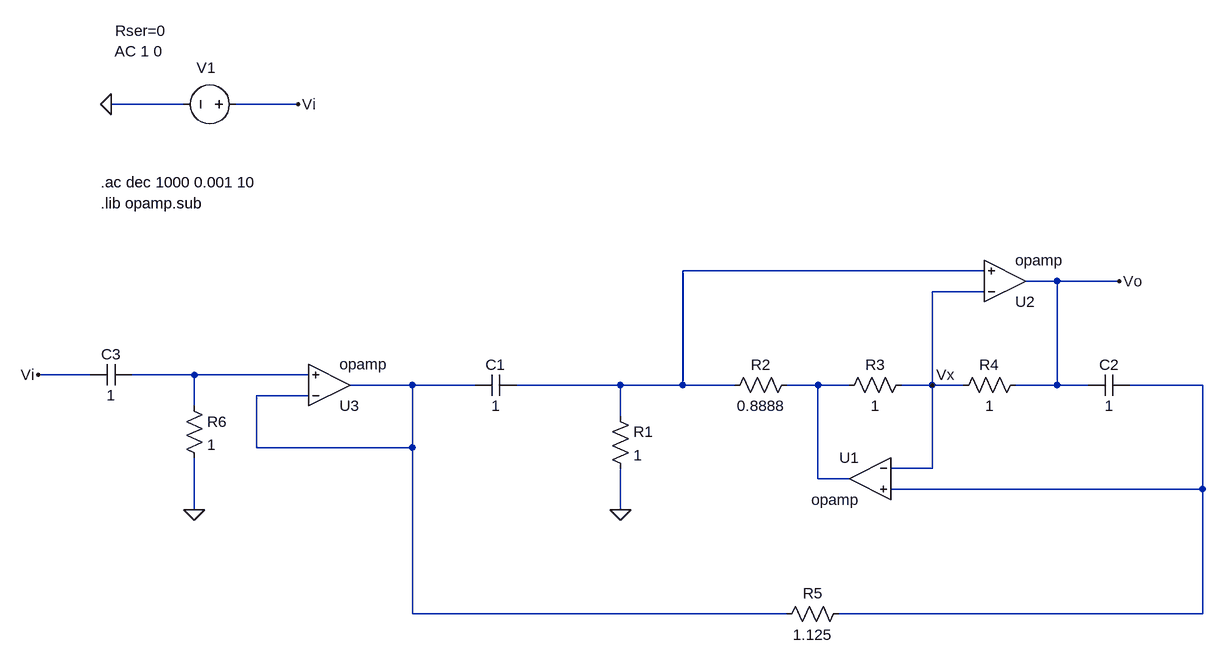
[diagram p0: schematic Circuit.asc]
Circuit.asc, the LTspice schematic file:
Version 4
SHEET 1 880 680
WIRE -784 -272 -896 -272
WIRE -608 -272 -704 -272
WIRE 448 -16 -16 -16
WIRE 560 0 512 0
WIRE 656 0 560 0
WIRE 448 16 368 16
WIRE -928 144 -1008 144
WIRE -768 144 -864 144
WIRE -592 144 -768 144
WIRE -432 160 -528 160
WIRE -336 160 -432 160
WIRE -112 160 -272 160
WIRE -16 160 -16 -16
WIRE -16 160 -112 160
WIRE 64 160 -16 160
WIRE 192 160 144 160
WIRE 240 160 192 160
WIRE 368 160 368 16
WIRE 368 160 320 160
WIRE 416 160 368 160
WIRE 560 160 560 0
WIRE 560 160 496 160
WIRE 608 160 560 160
WIRE 784 160 672 160
WIRE -592 176 -672 176
WIRE -768 192 -768 144
WIRE -112 208 -112 160
WIRE -672 256 -672 176
WIRE -432 256 -432 160
WIRE -432 256 -672 256
WIRE 368 288 368 160
WIRE 368 288 304 288
WIRE 192 304 192 160
WIRE 240 304 192 304
WIRE 784 320 784 160
WIRE 784 320 304 320
WIRE -768 352 -768 272
WIRE -112 352 -112 288
WIRE -432 512 -432 256
WIRE 144 512 -432 512
WIRE 784 512 784 320
WIRE 784 512 224 512
FLAG -112 352 0
FLAG 656 0 Vo
FLAG -608 -272 Vi
FLAG -896 -272 0
FLAG 368 160 Vx
FLAG -1008 144 Vi
FLAG -768 352 0
SYMBOL res -128 192 R0
SYMATTR InstName R1
SYMATTR Value 1
SYMBOL res 160 144 R90
WINDOW 0 0 56 VBottom 2
WINDOW 3 32 56 VTop 2
SYMATTR InstName R2
SYMATTR Value 0.8888
SYMBOL res 336 144 R90
WINDOW 0 0 56 VBottom 2
WINDOW 3 32 56 VTop 2
SYMATTR InstName R3
SYMATTR Value 1
SYMBOL res 512 144 R90
WINDOW 0 0 56 VBottom 2
WINDOW 3 32 56 VTop 2
SYMATTR InstName R4
SYMATTR Value 1
SYMBOL res 240 496 R90
WINDOW 0 0 56 VBottom 2
WINDOW 3 32 56 VTop 2
SYMATTR InstName R5
SYMATTR Value 1.125
SYMBOL cap -272 144 R90
WINDOW 0 0 32 VBottom 2
WINDOW 3 32 32 VTop 2
SYMATTR InstName C1
SYMATTR Value 1
SYMATTR SpiceLine Rser=0
SYMBOL cap 672 144 R90
WINDOW 0 0 32 VBottom 2
WINDOW 3 32 32 VTop 2
SYMATTR InstName C2
SYMATTR Value 1
SYMATTR SpiceLine Rser=0
SYMBOL OpAmps\\opamp 272 240 M0
SYMATTR InstName U1
SYMBOL OpAmps\\opamp 480 64 M180
SYMATTR InstName U2
SYMBOL voltage -688 -272 R90
WINDOW 123 -82 129 VRight 2
WINDOW 39 -113 123 VRight 2
WINDOW 0 -56 47 VRight 2
SYMATTR Value2 AC 1 0
SYMATTR SpiceLine Rser=0
SYMATTR InstName V1
SYMATTR Value ""
SYMBOL OpAmps\\opamp -560 224 M180
SYMATTR InstName U3
SYMBOL cap -864 128 R90
WINDOW 0 0 32 VBottom 2
WINDOW 3 32 32 VTop 2
SYMATTR InstName C3
SYMATTR Value 1
SYMATTR SpiceLine Rser=0
SYMBOL res -784 176 R0
SYMATTR InstName R6
SYMATTR Value 1
TEXT -912 -120 Left 2 !.lib opamp.sub
TEXT -912 -152 Left 2 !.ac dec 1000 0.001 10

The netlist it stands for:
* Circuit.asc
R1 N001 0 1
R2 N004 N001 0.8888
R3 Vx N004 1
R4 Vo Vx 1
R5 N005 N003 1.125
C1 N001 N003 1 Rser=0
C2 N005 Vo 1 Rser=0
XU1 Vx N005 N004 opamp Aol=100K GBW=10Meg  ; pins invin noninvin out
XU2 Vx N001 Vo opamp Aol=100K GBW=10Meg  ; pins invin noninvin out
V1 Vi 0 AC 1 0 Rser=0
XU3 N003 N002 N003 opamp Aol=100K GBW=10Meg  ; pins invin noninvin out
C3 N002 Vi 1 Rser=0
R6 N002 0 1
.lib opamp.sub
.ac dec 1000 0.001 10
.backanno
.end

* Results of the author's LTspice run, read from the files saved beside the schematic
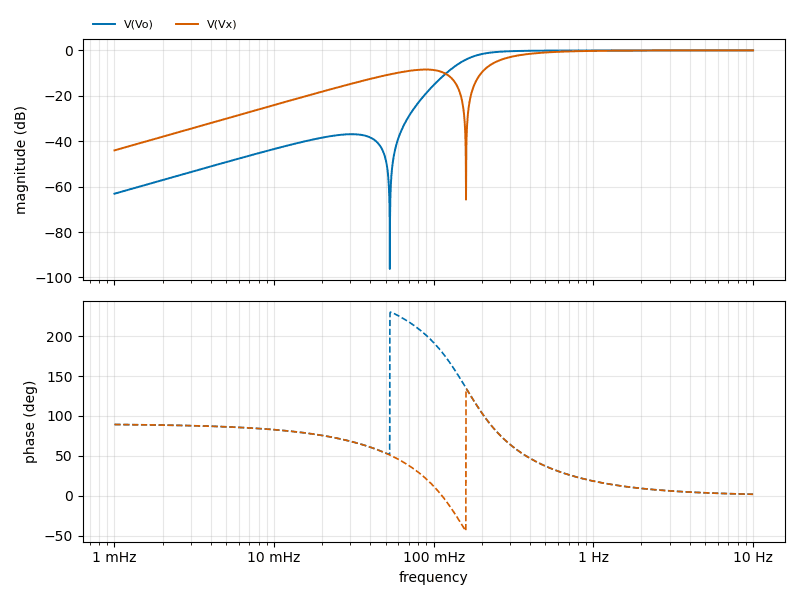
[diagram p1: AC Analysis of Circuit.asc, plotted from the saved traces]
* AC Analysis, 1 run:
*   V(Vo): -63.12 dB at 1 mHz, -0.00 dB at 10 Hz, peak -0.00 dB at 10 Hz, 3 dB below the peak at 171.6 mHz
*   V(Vx): -44.04 dB at 1 mHz, -0.00 dB at 10 Hz, peak -0.00 dB at 10 Hz, 3 dB below the peak at 298.2 mHz